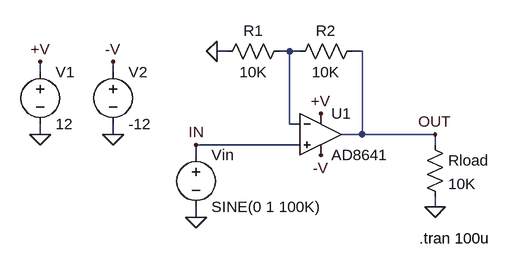
[diagram p0: schematic AD8641.asc]
AD8641.asc, the LTspice schematic file:
Version 4
SHEET 1 1240 700
WIRE 432 -1232 416 -1232
WIRE 528 -1232 512 -1232
WIRE 544 -1232 528 -1232
WIRE 640 -1232 624 -1232
WIRE 144 -1200 144 -1216
WIRE 256 -1200 256 -1216
WIRE 528 -1120 528 -1232
WIRE 544 -1120 528 -1120
WIRE 144 -1104 144 -1120
WIRE 256 -1104 256 -1120
WIRE 640 -1104 640 -1232
WIRE 640 -1104 608 -1104
WIRE 752 -1104 640 -1104
WIRE 544 -1088 384 -1088
WIRE 752 -1088 752 -1104
WIRE 384 -1072 384 -1088
WIRE 752 -992 752 -1008
WIRE 384 -976 384 -992
FLAG 384 -976 0
FLAG 752 -1104 OUT
FLAG 384 -1088 IN
FLAG 576 -1136 +V
FLAG 576 -1072 -V
FLAG 416 -1232 0
FLAG 752 -992 0
FLAG 144 -1216 +V
FLAG 256 -1216 -V
FLAG 256 -1104 0
FLAG 144 -1104 0
SYMBOL voltage 384 -1088 R0
WINDOW 123 24 146 Left 2
WINDOW 39 24 125 Left 2
SYMATTR InstName Vin
SYMATTR Value SINE(0 1 100K)
SYMBOL res 528 -1248 R90
WINDOW 0 0 56 VBottom 2
WINDOW 3 32 56 VTop 2
SYMATTR InstName R1
SYMATTR Value 10K
SYMBOL res 640 -1248 R90
WINDOW 0 0 56 VBottom 2
WINDOW 3 32 56 VTop 2
SYMATTR InstName R2
SYMATTR Value 10K
SYMBOL Opamps\\AD8641 576 -1168 R0
SYMATTR InstName U1
SYMBOL res 736 -1104 R0
SYMATTR InstName Rload
SYMATTR Value 10K
SYMBOL voltage 144 -1216 R0
WINDOW 123 0 0 Left 2
WINDOW 39 0 0 Left 2
SYMATTR InstName V1
SYMATTR Value 12
SYMBOL voltage 256 -1216 R0
WINDOW 123 24 146 Left 2
WINDOW 39 24 125 Left 2
SYMATTR InstName V2
SYMATTR Value -12
TEXT 728 -944 Left 2 !.tran 100u

The netlist it stands for:
* AD8641.asc
Vin IN 0 SINE(0 1 100K)
R1 N001 0 10K
R2 OUT N001 10K
XU1 IN N001 +V -V OUT AD8641  ; pins In+ In- V+ V- OUT
Rload OUT 0 10K
V1 +V 0 12
V2 -V 0 -12
.tran 100u
.backanno
.end